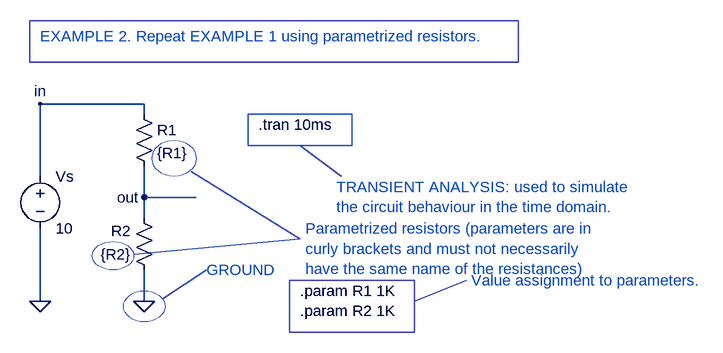
[diagram p0: schematic example-002.asc]
example-002.asc, the LTspice schematic file:
Version 4
SHEET 1 1472 680
WIRE 304 128 144 128
WIRE 304 144 304 128
WIRE 144 240 144 128
WIRE 304 272 304 224
WIRE 384 272 304 272
WIRE 304 304 304 272
WIRE 144 432 144 320
WIRE 304 432 304 384
FLAG 304 432 0
FLAG 144 432 0
FLAG 144 128 in
FLAG 304 272 out
SYMBOL voltage 144 224 R0
SYMATTR InstName Vs
SYMATTR Value 10
SYMBOL Res 320 400 R180
WINDOW 0 36 76 Left 2
WINDOW 3 36 40 Left 2
SYMATTR InstName R2
SYMATTR Value {R2}
SYMBOL Res 288 128 R0
SYMATTR InstName R1
SYMATTR Value {R1}
TEXT 144 24 Left 2 ;EXAMPLE 2. Repeat EXAMPLE 1 using parametrized resistors.
TEXT 400 384 Left 2 ;GROUND
TEXT 480 160 Left 2 !.tran 10ms
TEXT 600 256 Left 2 ;TRANSIENT ANALYSIS: used to simulate \nthe circuit behaviour in the time domain.
TEXT 552 320 Left 2 ;Parametrized resistors (parameters are in\ncurly brackets and must not necessarily\nhave the same name of the resistances)
TEXT 544 416 Left 2 !.param R1 1K\n.param R2 1K
TEXT 808 400 Left 2 ;Value assignment to parameters.
LINE Normal 400 384 332 428
LINE Normal 544 192 608 240
LINE Normal 376 232 544 336
LINE Normal 544 336 288 360
LINE Normal 800 400 720 432
RECTANGLE Normal 128 0 880 64
RECTANGLE Normal 464 144 624 192
RECTANGLE Normal 528 400 720 480
CIRCLE Normal 272 416 336 464 2
CIRCLE Normal 316 184 384 240 2
CIRCLE Normal 224 340 288 384 2

The netlist it stands for:
* example-002.asc
Vs in 0 10
R2 0 out {R2}
R1 in out {R1}
* EXAMPLE 2. Repeat EXAMPLE 1 using parametrized resistors.
* GROUND
.tran 10ms
* TRANSIENT ANALYSIS: used to simulate
* the circuit behaviour in the time domain.
* Parametrized resistors (parameters are in
* curly brackets and must not necessarily
* have the same name of the resistances)
.param R1 1K
.param R2 1K
* Value assignment to parameters.
.backanno
.end